# Altium project Test_project.PrjPcb
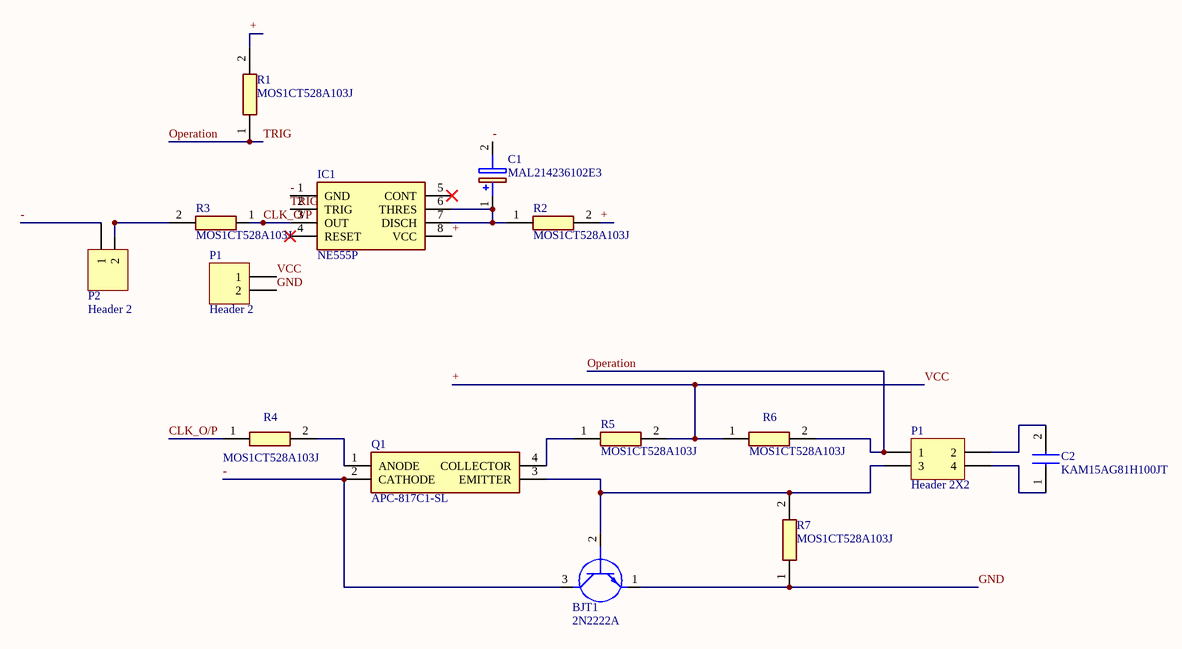
[diagram p0: Test_project.SchDoc]
1 sheet, 15 parts. Net scope: global (net labels, ports and power ports of the same name join across sheets).
Board file: Test_project.PcbDoc

## Sheet Test_project.SchDoc
size A4; SheetNumber: 1; SheetTotal: 1; SPICEModelCacheUAAAZVAE: <root> / <DocumentId>UAAAZVAE</DocumentId> / </root>

### Parts
(Parts that share a designator on the sheet are numbered #1, #2 ... from top to bottom, then left to right.)
BJT1  2N2222A  [2N2222A]
C1  MAL214236102E3  [CAPPRD500W60D1050H2200]
C2  KAM15AG81H100JT  [CAPC1608X90N]
IC1  NE555P  [DIP794W53P254L959H508Q8N]
P1#1  Header 2  [HDR1X2]
P1#2  Header 2X2  [HDR2X2]
P2  Header 2  [HDR1X2]
Q1  APC-817C1-SL  [APC817C1SL]
R1  MOS1CT528A103J  [RESAD2100W80L900D300]
R2  MOS1CT528A103J  [RESAD2100W80L900D300]
R3  MOS1CT528A103J  [RESAD2100W80L900D300]
R4  MOS1CT528A103J  [RESAD2100W80L900D300]
R5  MOS1CT528A103J  [RESAD2100W80L900D300]
R6  MOS1CT528A103J  [RESAD2100W80L900D300]
R7  MOS1CT528A103J  [RESAD2100W80L900D300]

### Nets
+: IC1.8(VCC) P1#1.1 R1.2 R2.2 R5.2 R6.1  [also labelled VCC]
-: BJT1.3(C) C1.2(-) IC1.1(GND) P2.1 Q1.2(CATHODE)
CLK_O/P: IC1.3(OUT) R3.1 R4.1
GND: BJT1.1(E) P1#1.2 R7.1
Operation: IC1.2(TRIG) P1#2.1 R1.1 R6.2  [also labelled TRIG]
NetBJT1_2: BJT1.2(B) P1#2.3 Q1.3(EMITTER) R7.2
NetC1_1: C1.1(+) IC1.6(THRES) IC1.7(DISCH) R2.1
NetC2_1: C2.1 P1#2.4
NetC2_2: C2.2 P1#2.2
NetP2_2: P2.2 R3.2
NetQ1_1: Q1.1(ANODE) R4.2
NetQ1_4: Q1.4(COLLECTOR) R5.1

Not connected (* = marked no-connect by the designer): IC1 4(RESET)* 5(CONT)*

### Library data of the parts
BJT1 = 2N2222A: Transistor BJT NPN; Manufacturer_Name: Diotec; Datasheet Link: https://diotec.com/request/datasheet/2n2222a.pdf; Height: 7.5mm; Manufacturer_Part_Number: 2N2222A; Mouser Part Number: 637-2N2222A; Mouser Price/Stock: https://www.mouser.co.uk/ProductDetail/Diotec-Semiconductor/2N2222A?qs=OlC7AqGiEDmNlRSTGL2dYg%3D%3D; Arrow Part Number: 2N2222A; Arrow Price/Stock: https://www.arrow.com/en/products/2n2222a/diotec-semiconductor-ag
C1 = MAL214236102E3: Capacitor Polarised; Manufacturer_Name: Vishay; Datasheet Link: http://www.vishay.com/docs/28402/142rhs.pdf; Height: 22mm; Manufacturer_Part_Number: MAL214236102E3; Mouser Part Number: 594-MAL214236102E3; Mouser Price/Stock: https://www.mouser.co.uk/ProductDetail/Vishay-BC-Components/MAL214236102E3?qs=Ep9Lwju7gVqCnoasHklGbw%3D%3D
C2 = KAM15AG81H100JT: Capacitor; Manufacturer_Name: Kyocera AVX; Datasheet Link: https://datasheets.kyocera-avx.com/AutoMLCCKAM.pdf; Height: 0.9mm; Manufacturer_Part_Number: KAM15AG81H100JT
IC1 = NE555P: Integrated Circuit; Manufacturer_Name: Texas Instruments; Datasheet Link: http://www.ti.com/lit/ds/symlink/ne555.pdf; Height: 5.08mm; Manufacturer_Part_Number: NE555P; Mouser Part Number: 595-NE555P; Mouser Price/Stock: https://www.mouser.co.uk/ProductDetail/Texas-Instruments/NE555P?qs=rkhjVJ6%2F3EIf4CWgjIKuKQ%3D%3D; Arrow Part Number: NE555P; Arrow Price/Stock: https://www.arrow.com/en/products/ne555p/texas-instruments?utm_currency=USD&region=europe
P1#1 P2 = Header 2: Header, 2-Pin; LatestRevisionDate: 17-Jul-2002; LatestRevisionNote: Re-released for DXP Platform.; Publisher: Altium Limited
P1#2 = Header 2X2: Header, 2-Pin, Dual row; LatestRevisionDate: 17-Jul-2002; LatestRevisionNote: Re-released for DXP Platform.; Publisher: Altium Limited
Q1 = APC-817C1-SL: Phototransistor; Manufacturer_Name: American Bright LED; Datasheet Link: https://www.americanbrightled.com/pdffiles/ir-uv/ir/APC-817.pdf; Height: 3.8mm; Manufacturer_Part_Number: APC-817C1-SL; Mouser Part Number: 442-APC817C1SL; Mouser Price/Stock: https://www.mouser.co.uk/ProductDetail/American-Bright-LED/APC-817C1-SL?qs=Y0Uzf4wQF3lGQlk7OLeIsw%3D%3D
R1-R7 = MOS1CT528A103J: Resistor; Manufacturer_Name: KOA Speer; Datasheet Link: https://mouser.componentsearchengine.com/Datasheets/1/MOS1CT528A103J.pdf; Manufacturer_Part_Number: MOS1CT528A103J; Mouser Part Number: 660-MOS1CT528A103J; Mouser Price/Stock: https://www.mouser.co.uk/ProductDetail/KOA-Speer/MOS1CT528A103J?qs=lc2O%252BfHJPVanf9VOC6Ilbg%3D%3D